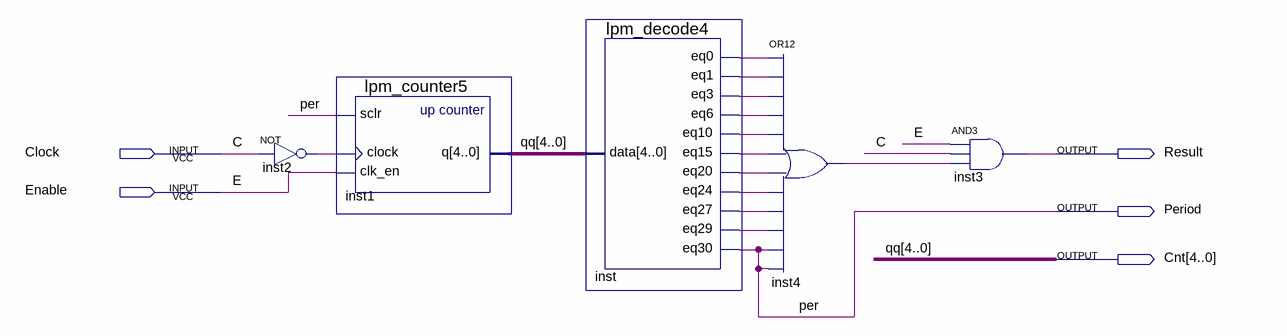
[diagram p0: schematic sheet]
// Quartus schematic dc_scheme.bdf as structural Verilog: 5 symbols, 5 pins
module dc_scheme (
  input  Clock,
  input  Enable,
  output Result,
  output Period,
  output [4:0] Cnt
);

  wire inst2_out, inst4_out, inst_eq0, inst_eq1, inst_eq3, inst_eq6, inst_eq10, inst_eq15, inst_eq20,
       inst_eq24, inst_eq27, inst_eq29;

  not inst2 (inst2_out, Clock);
  lpm_counter5 inst1 (.sclr(Period), .clock(inst2_out), .clk_en(Enable), .q(Cnt));
  lpm_decode4 inst (
    .data(Cnt), .eq0(inst_eq0), .eq1(inst_eq1), .eq3(inst_eq3), .eq6(inst_eq6), .eq10(inst_eq10),
    .eq15(inst_eq15), .eq20(inst_eq20), .eq24(inst_eq24), .eq27(inst_eq27), .eq29(inst_eq29), .eq30(Period));
  or inst4 (inst4_out, inst_eq0, inst_eq1, inst_eq3, inst_eq6, inst_eq10, inst_eq15, inst_eq20, inst_eq24, inst_eq27, inst_eq29, Period, Period);
  and inst3 (Result, Enable, Clock, inst4_out);

  // Other names for the same wires on the sheet: C = Clock; E = Enable; per = Period; qq[4:0] = Cnt
endmodule
